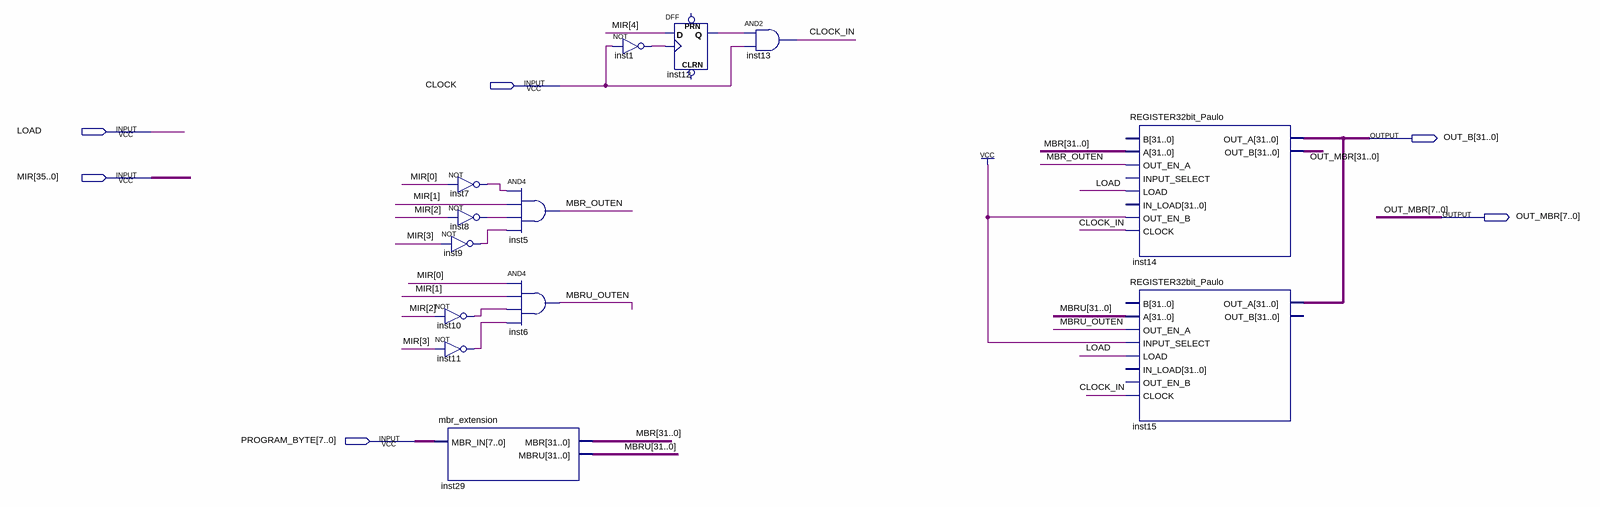
[diagram p0: schematic sheet]
// Quartus schematic MBR.bdf as structural Verilog: 13 symbols, 6 pins
module MBR (
  input  CLOCK,
  input  LOAD,
  input  [35:0] MIR,
  input  [7:0] PROGRAM_BYTE,
  output [31:0] OUT_B,
  output [31:0] OUT_MBR
);

  wire CLOCK_IN, inst1_out, inst7_out, inst8_out, inst9_out, inst10_out, inst11_out, inst12_q, MBR_OUTEN,
       MBRU_OUTEN;
  wire [31:0] MBR, MBRU;

  not inst9 (inst9_out, MIR[3]);
  not inst10 (inst10_out, MIR[2]);
  not inst11 (inst11_out, MIR[3]);
  mbr_extension inst29 (.MBR_IN(PROGRAM_BYTE), .MBR(MBR), .MBRU(MBRU));
  not inst7 (inst7_out, MIR[0]);
  not inst8 (inst8_out, MIR[2]);
  and inst5 (MBR_OUTEN, inst7_out, MIR[1], inst8_out, inst9_out);
  and inst6 (MBRU_OUTEN, MIR[0], MIR[1], inst10_out, inst11_out);
  not inst1 (inst1_out, CLOCK);
  DFF inst12 (.CLK(inst1_out), .D(MIR[4]), .Q(inst12_q));  // open: CLRN, PRN
  and inst13 (CLOCK_IN, inst12_q, CLOCK);
  REGISTER32bit_Paulo inst14 (
    .A(MBR), .OUT_EN_A(MBR_OUTEN), .LOAD(LOAD), .OUT_EN_B(1'b1), .CLOCK(CLOCK_IN), .OUT_A(OUT_B),
    .OUT_B(OUT_MBR));  // open: B, INPUT_SELECT, IN_LOAD
  REGISTER32bit_Paulo inst15 (
    .A(MBRU), .OUT_EN_A(MBRU_OUTEN), .INPUT_SELECT(1'b1), .LOAD(LOAD), .CLOCK(CLOCK_IN), .OUT_A(OUT_B));  // open: B, IN_LOAD, OUT_EN_B, OUT_B
endmodule
